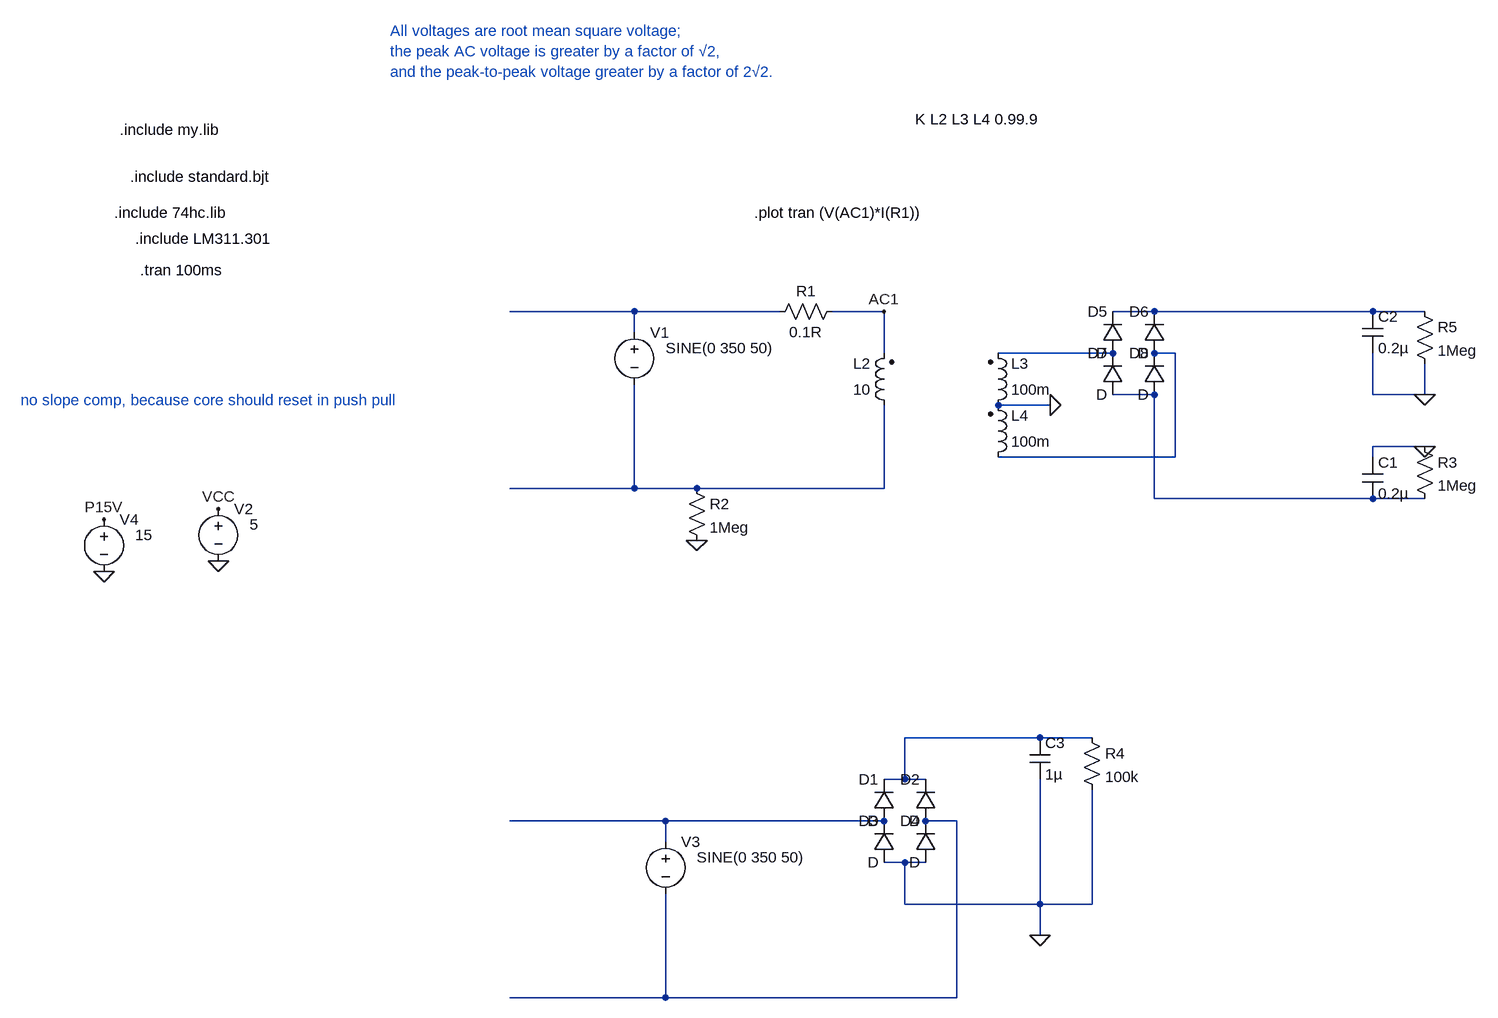
[diagram p0: schematic Draft01.asc]
Draft01.asc, the LTspice schematic file:
Version 4
SHEET 1 5720 1740
WIRE 592 -160 400 -160
WIRE 816 -160 592 -160
WIRE 976 -160 896 -160
WIRE 1392 -160 1328 -160
WIRE 1728 -160 1392 -160
WIRE 1808 -160 1728 -160
WIRE 592 -128 592 -160
WIRE 976 -96 976 -160
WIRE 1328 -96 1152 -96
WIRE 1424 -96 1392 -96
WIRE 1392 -32 1328 -32
WIRE 1728 -32 1728 -96
WIRE 1808 -32 1808 -80
WIRE 1808 -32 1728 -32
WIRE 1232 -16 1152 -16
WIRE 1808 48 1728 48
WIRE 1424 64 1424 -96
WIRE 1424 64 1152 64
WIRE 1728 64 1728 48
WIRE 592 112 592 -48
WIRE 592 112 400 112
WIRE 688 112 592 112
WIRE 976 112 976 -16
WIRE 976 112 688 112
WIRE 1392 128 1392 -32
WIRE 1728 128 1392 128
WIRE 1808 128 1728 128
WIRE 1216 496 1008 496
WIRE 1296 496 1216 496
WIRE 1008 560 1008 496
WIRE 1008 560 976 560
WIRE 1040 560 1008 560
WIRE 640 624 400 624
WIRE 976 624 640 624
WIRE 1088 624 1040 624
WIRE 640 656 640 624
WIRE 1008 688 976 688
WIRE 1040 688 1008 688
WIRE 1008 752 1008 688
WIRE 1216 752 1216 560
WIRE 1216 752 1008 752
WIRE 1296 752 1296 576
WIRE 1296 752 1216 752
WIRE 1216 800 1216 752
WIRE 640 896 640 736
WIRE 640 896 400 896
WIRE 1088 896 1088 624
WIRE 1088 896 640 896
FLAG -48 224 0
FLAG -48 144 VCC
FLAG -224 240 0
FLAG -224 160 P15V
FLAG 1808 -32 0
FLAG 1232 -16 0
FLAG 1808 48 0
FLAG 688 192 0
FLAG 1216 800 0
FLAG 976 -160 AC1
SYMBOL voltage -48 128 R0
WINDOW 123 0 0 Left 0
WINDOW 39 0 0 Left 0
WINDOW 3 48 40 Left 2
SYMATTR Value 5
SYMATTR InstName V2
SYMBOL ind2 1136 0 M180
WINDOW 0 36 80 Left 2
WINDOW 3 36 40 Left 2
SYMATTR InstName L3
SYMATTR Value 100m
SYMATTR Type ind
SYMBOL voltage -224 144 R0
WINDOW 123 0 0 Left 0
WINDOW 39 0 0 Left 0
WINDOW 3 48 40 Left 2
SYMATTR Value 15
SYMATTR InstName V4
SYMBOL ind2 992 0 R180
WINDOW 0 36 80 Left 2
WINDOW 3 36 40 Left 2
SYMATTR InstName L2
SYMATTR Value 10
SYMATTR Type ind
SYMBOL diode 1344 -96 R180
WINDOW 0 24 64 Left 2
WINDOW 3 24 0 Left 2
SYMATTR InstName D5
SYMBOL diode 1408 -96 R180
WINDOW 0 24 64 Left 2
WINDOW 3 24 0 Left 2
SYMATTR InstName D6
SYMBOL diode 1344 -32 R180
WINDOW 0 24 64 Left 2
WINDOW 3 24 0 Left 2
SYMATTR InstName D7
SYMBOL diode 1408 -32 R180
WINDOW 0 24 64 Left 2
WINDOW 3 24 0 Left 2
SYMATTR InstName D8
SYMBOL cap 1712 -160 R0
SYMATTR InstName C2
SYMATTR Value 0.2µ
SYMBOL res 1792 -176 R0
SYMATTR InstName R5
SYMATTR Value 1Meg
SYMBOL ind2 1136 80 M180
WINDOW 0 36 80 Left 2
WINDOW 3 36 40 Left 2
SYMATTR InstName L4
SYMATTR Value 100m
SYMATTR Type ind
SYMBOL cap 1712 64 R0
SYMATTR InstName C1
SYMATTR Value 0.2µ
SYMBOL res 1792 32 R0
SYMATTR InstName R3
SYMATTR Value 1Meg
SYMBOL voltage 592 -144 R0
WINDOW 123 0 0 Left 0
WINDOW 39 0 0 Left 0
WINDOW 3 48 40 Left 2
SYMATTR Value SINE(0 350 50)
SYMATTR InstName V1
SYMBOL res 912 -176 R90
WINDOW 0 0 56 VBottom 2
WINDOW 3 32 56 VTop 2
SYMATTR InstName R1
SYMATTR Value 0.1R
SYMBOL res 672 96 R0
SYMATTR InstName R2
SYMATTR Value 1Meg
SYMBOL voltage 640 640 R0
WINDOW 123 0 0 Left 0
WINDOW 39 0 0 Left 0
WINDOW 3 48 40 Left 2
SYMATTR Value SINE(0 350 50)
SYMATTR InstName V3
SYMBOL diode 992 624 R180
WINDOW 0 24 64 Left 2
WINDOW 3 24 0 Left 2
SYMATTR InstName D1
SYMBOL diode 1056 624 R180
WINDOW 0 24 64 Left 2
WINDOW 3 24 0 Left 2
SYMATTR InstName D2
SYMBOL diode 992 688 R180
WINDOW 0 24 64 Left 2
WINDOW 3 24 0 Left 2
SYMATTR InstName D3
SYMBOL diode 1056 688 R180
WINDOW 0 24 64 Left 2
WINDOW 3 24 0 Left 2
SYMATTR InstName D4
SYMBOL res 1280 480 R0
SYMATTR InstName R4
SYMATTR Value 100k
SYMBOL cap 1200 496 R0
SYMATTR InstName C3
SYMATTR Value 1µ
TEXT -168 -224 Left 2 !.tran 100ms
TEXT -208 -312 Left 2 !.include 74hc.lib
TEXT 1024 -456 Left 2 !K L2 L3 L4 0.99.9
TEXT -184 -368 Left 2 !.include standard.bjt
TEXT -176 -272 Left 2 !.include LM311.301
TEXT -352 -24 Left 2 ;no slope comp, because core should reset in push pull
TEXT -200 -440 Left 2 !.include my.lib
TEXT 216 -592 Left 2 ;All voltages are root mean square voltage; \nthe peak AC voltage is greater by a factor of √2, \nand the peak-to-peak voltage greater by a factor of 2√2.
TEXT 776 -312 Left 2 !.plot tran (V(AC1)*I(R1))

The netlist it stands for:
* Draft01.asc
V2 VCC 0 5
L3 0 N003 100m
V4 P15V 0 15
L2 N006 AC1 10
D5 N003 N002 D
D6 N004 N002 D
D7 N005 N003 D
D8 N005 N004 D
C2 N002 0 0.2µ
R5 N002 0 1Meg
L4 N004 0 100m
C1 0 N005 0.2µ
R3 0 N005 1Meg
V1 N001 N006 SINE(0 350 50)
R1 AC1 N001 0.1R
R2 N006 0 1Meg
V3 N008 N009 SINE(0 350 50)
D1 N008 N007 D
D2 N009 N007 D
D3 0 N008 D
D4 0 N009 D
R4 N007 0 100k
C3 N007 0 1µ
.model D D
.lib standard.dio
.tran 100ms
.include 74hc.lib
K L2 L3 L4 0.99.9
.include standard.bjt
.include LM311.301
* no slope comp, because core should reset in push pull
.include my.lib
* All voltages are root mean square voltage;
* the peak AC voltage is greater by a factor of √2,
* and the peak-to-peak voltage greater by a factor of 2√2.
.plot tran (V(AC1)*I(R1))
.backanno
.end